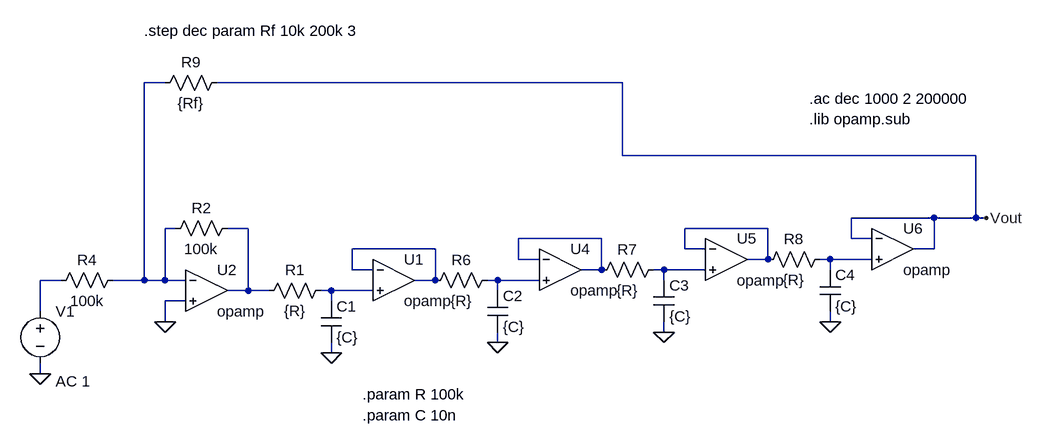
[diagram p0: schematic low-pass with feedback.asc]
low-pass with feedback.asc, the LTspice schematic file:
Version 4
SHEET 1 1184 1112
WIRE -240 496 -272 496
WIRE 464 496 -160 496
WIRE 464 608 464 496
WIRE 1008 608 464 608
WIRE 944 704 816 704
WIRE 1008 704 1008 608
WIRE 1008 704 944 704
WIRE 1024 704 1008 704
WIRE -224 720 -240 720
WIRE -112 720 -144 720
WIRE 688 720 560 720
WIRE 432 736 304 736
WIRE 816 736 816 704
WIRE 848 736 816 736
WIRE 176 752 48 752
WIRE 560 752 560 720
WIRE 592 752 560 752
WIRE 944 752 944 704
WIRE 944 752 912 752
WIRE 304 768 304 736
WIRE 336 768 304 768
WIRE 688 768 688 720
WIRE 688 768 656 768
WIRE 784 768 768 768
WIRE 848 768 784 768
WIRE 48 784 48 752
WIRE 80 784 48 784
WIRE 432 784 432 736
WIRE 432 784 400 784
WIRE 528 784 512 784
WIRE 592 784 528 784
WIRE 784 784 784 768
WIRE -400 800 -432 800
WIRE -272 800 -272 496
WIRE -272 800 -320 800
WIRE -240 800 -240 720
WIRE -240 800 -272 800
WIRE -208 800 -240 800
WIRE 176 800 176 752
WIRE 176 800 144 800
WIRE 272 800 256 800
WIRE 336 800 272 800
WIRE 528 800 528 784
WIRE -112 816 -112 720
WIRE -112 816 -144 816
WIRE -80 816 -112 816
WIRE 16 816 0 816
WIRE 80 816 16 816
WIRE 272 816 272 800
WIRE -208 832 -240 832
WIRE 16 832 16 816
WIRE -432 848 -432 800
WIRE -240 864 -240 832
WIRE 784 864 784 848
WIRE 528 880 528 864
WIRE 272 896 272 880
WIRE 16 912 16 896
WIRE -432 944 -432 928
FLAG 16 912 0
FLAG -432 944 0
FLAG 1024 704 Vout
FLAG -240 864 0
FLAG 272 896 0
FLAG 528 880 0
FLAG 784 864 0
SYMBOL Opamps\\opamp 112 736 R0
SYMATTR InstName U1
SYMBOL cap 0 832 R0
SYMATTR InstName C1
SYMATTR Value {C}
SYMBOL res -96 832 R270
WINDOW 0 32 56 VTop 2
WINDOW 3 0 56 VBottom 2
SYMATTR InstName R1
SYMATTR Value {R}
SYMBOL voltage -432 832 R0
WINDOW 123 24 124 Left 2
WINDOW 39 0 0 Left 2
SYMATTR InstName V1
SYMATTR Value ""
SYMATTR Value2 AC 1
SYMBOL Opamps\\opamp -176 752 R0
SYMATTR InstName U2
SYMBOL res -416 816 R270
WINDOW 0 32 56 VTop 2
WINDOW 3 0 56 VBottom 2
SYMATTR InstName R4
SYMATTR Value 100k
SYMBOL res -240 736 R270
WINDOW 0 32 56 VTop 2
WINDOW 3 0 56 VBottom 2
SYMATTR InstName R2
SYMATTR Value 100k
SYMBOL Opamps\\opamp 368 720 R0
SYMATTR InstName U4
SYMBOL Opamps\\opamp 624 704 R0
SYMATTR InstName U5
SYMBOL Opamps\\opamp 880 688 R0
SYMATTR InstName U6
SYMBOL res -256 512 R270
WINDOW 0 32 56 VTop 2
WINDOW 3 0 56 VBottom 2
SYMATTR InstName R9
SYMATTR Value {Rf}
SYMBOL cap 256 816 R0
SYMATTR InstName C2
SYMATTR Value {C}
SYMBOL res 160 816 R270
WINDOW 0 32 56 VTop 2
WINDOW 3 0 56 VBottom 2
SYMATTR InstName R6
SYMATTR Value {R}
SYMBOL cap 512 800 R0
SYMATTR InstName C3
SYMATTR Value {C}
SYMBOL res 416 800 R270
WINDOW 0 32 56 VTop 2
WINDOW 3 0 56 VBottom 2
SYMATTR InstName R7
SYMATTR Value {R}
SYMBOL cap 768 784 R0
SYMATTR InstName C4
SYMATTR Value {C}
SYMBOL res 672 784 R270
WINDOW 0 32 56 VTop 2
WINDOW 3 0 56 VBottom 2
SYMATTR InstName R8
SYMATTR Value {R}
TEXT 752 552 Left 2 !.lib opamp.sub
TEXT 752 520 Left 2 !.ac dec 1000 2 200000
TEXT -272 416 Left 2 !.step dec param Rf 10k 200k 3
TEXT 64 976 Left 2 !.param R 100k
TEXT 64 1008 Left 2 !.param C 10n

The netlist it stands for:
* low-pass with feedback.asc
XU1 N005 N010 N005 opamp Aol=100K GBW=10Meg  ; pins invin noninvin out
C1 N010 0 {C}
R1 N002 N010 {R}
V1 N008 0 AC 1
XU2 N001 0 N002 opamp Aol=100K GBW=10Meg  ; pins invin noninvin out
R4 N008 N001 100k
R2 N001 N002 100k
XU4 N004 N009 N004 opamp Aol=100K GBW=10Meg  ; pins invin noninvin out
XU5 N003 N007 N003 opamp Aol=100K GBW=10Meg  ; pins invin noninvin out
XU6 Vout N006 Vout opamp Aol=100K GBW=10Meg  ; pins invin noninvin out
R9 N001 Vout {Rf}
C2 N009 0 {C}
R6 N005 N009 {R}
C3 N007 0 {C}
R7 N004 N007 {R}
C4 N006 0 {C}
R8 N003 N006 {R}
.lib opamp.sub
.ac dec 1000 2 200000
.step dec param Rf 10k 200k 3
.param R 100k
.param C 10n
.backanno
.end